# Altium schematic sheet Sheet1.SchDoc
size A4; SheetNumber: 1; SheetTotal: 1; SPICEModelCacheXMELULDJ: <root> / <DocumentId>XMELULDJ</DocumentId> / </root>
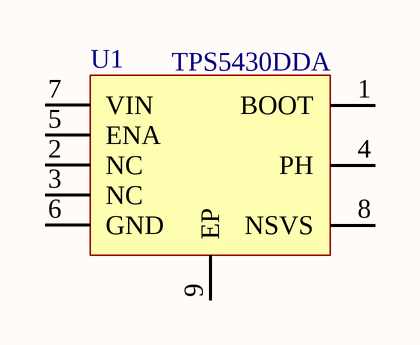
[diagram p0: Sheet1.SchDoc]

## Parts
U1  TPS5430DDA  [VREG_LM5017MR/NOPB]

## Nets

Not connected (* = marked no-connect by the designer): U1 1(BOOT) 2(NC) 3(NC) 4(PH) 5(ENA) 6(GND) 7(VIN) 8(NSVS) 9(EP)